# Altium project IBB.PrjPcb (part 7 of 12)
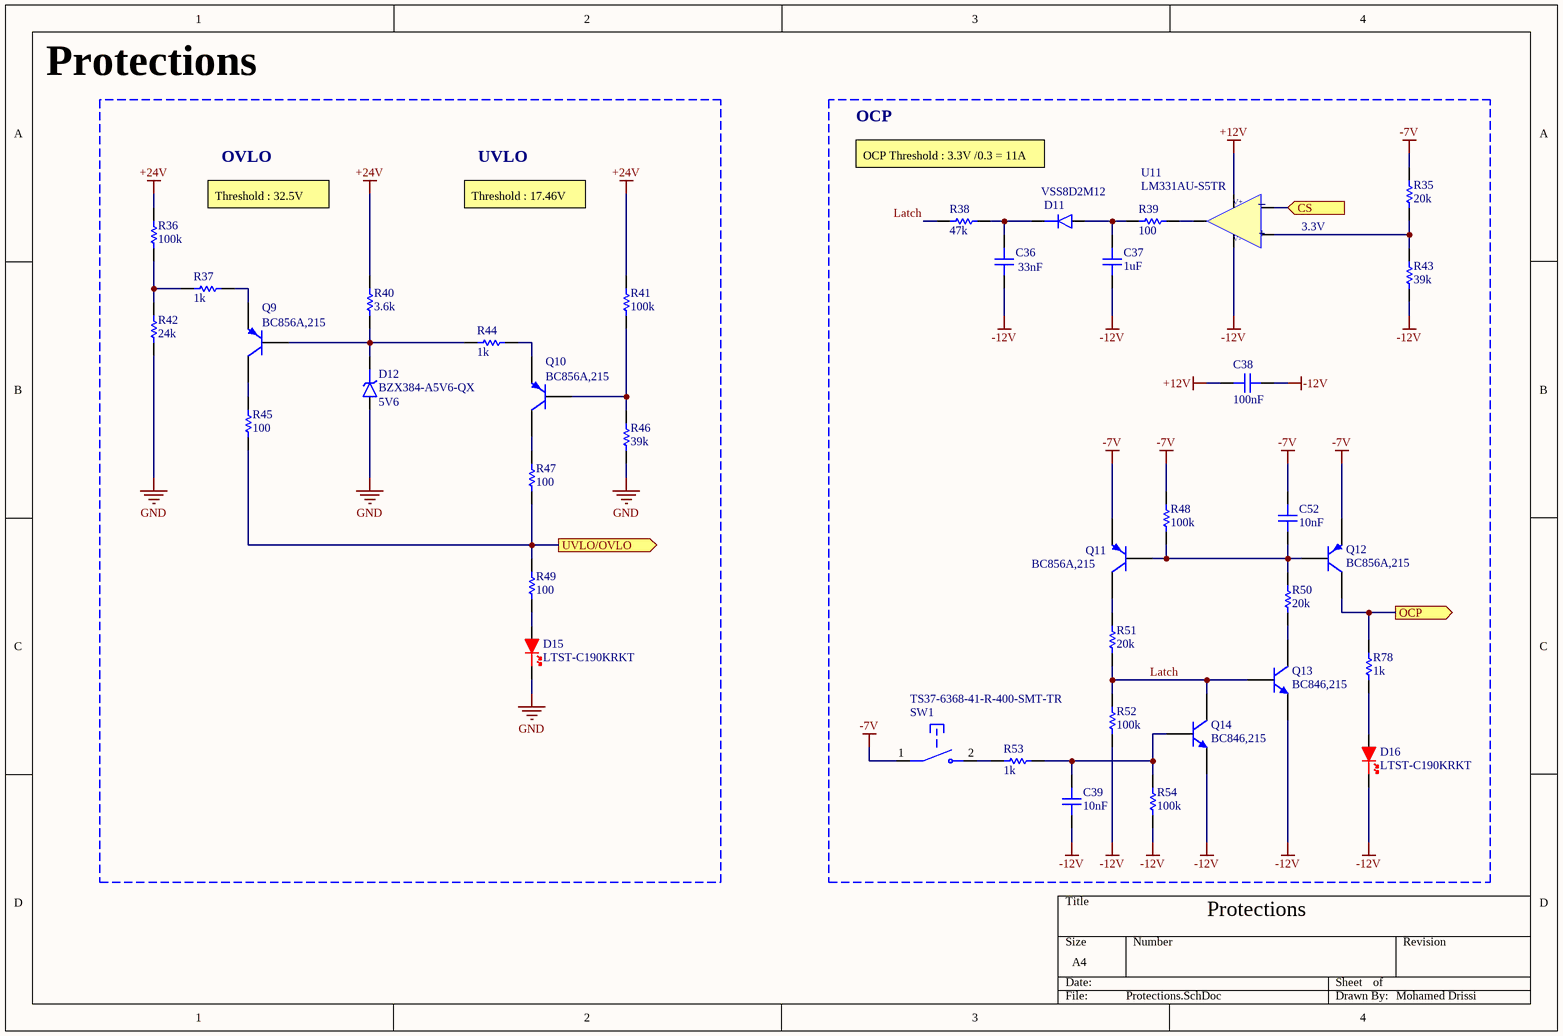
[diagram p12: Protections.SchDoc]

## Sheet Protections.SchDoc (continued)

### Library data of the parts (continued)
R38 = Yageo RC0603FR-0747KL: Res Thick Film 0603 47K Ohm 1% 1/10W ±100ppm/°C Molded SMD Paper T/R; Manufacturer: Yageo Group; Max Power Dissipation: 100mW; Voltage Rating: 50V; Working Voltage: 75V; Supplier: RS; Supplier Part Number: 1995581P; Manufacturer Part Number: RC0603FR-0747KL; RoHS: Compliant; Category: Chip SMD Resistors; Stock: 23900; Pricing: 1000=0,007, 2500=0,007, 5000=0,006, 10000=0,005 (EUR); Case/Package: 0603; Case Code (Imperial): 0603; Case Code (Metric): 1608; China RoHS: Non-Compliant; Composition: Thick Film; Contact Plating: Tin; Country of Origin: Mainland China, Taiwan; Depth: 800µm; Export Control Classification Number (ECCN) Code: EAR99; Features: Moisture Resistant; Height: 450µm; Harmonized Tariff Schedule (HTS) Code: 8533.21.00.30; Introduction Date: 2008-07-18; Lead Free: Lead Free; Length: 1.6mm; Lifecycle Status: Production; Max Operating Temperature: 155°C; Military Standard: Not; Min Operating Temperature: -55°C; Mounting Technology: Surface Mount; Pins: 2; Number of Terminals: 2; Number of Terminations: 2; Packaging: Tape and Reel; Power Rating: 100mW; Radiation Hardening: No; REACH SVHC: Yes; Schedule B: 8533210045, 8533210045|8533210045|8533210045|8533210045|8533210045|8533210045|8533210045|8533210045|8533210045|8533210045|8533210045|8533210045|8533210045, 8533210045|8533210045|8533210045|8533210045|8533210045|8533210045|8533210045|8533210045|8533210045|8533210045|8533210045|8533210045|8533210045|8533210045, 8533210045|8533210045|8533210045|8533210045|8533210045|8533210045|8533210045|8533210045|8533210045|8533210045|8533210045|8533210045|8533210045|8533210045|8533210045; Temperature Coefficient: 100ppm/°C; Termination: SMD/SMT; Tolerance: 1%; Voltage Rating (AC): 50V; Voltage Rating (DC): 50V; Width: 800µm; ComponentLink1URL: https://datasheet.octopart.com:443/RC0603FR-0747KL-Yageo-datasheet-175887523.pdf?src-supplier=Newark; ComponentLink1Description: https://datasheet.octopart.com:443/RC0603FR-0747KL-Yageo-datasheet-175887523.pdf?src-supplier=Newark; ComponentLink2URL: https://datasheet.octopart.com:443/RC0603FR-0747KL-Yageo-datasheet-62067350.pdf?src-supplier=Newark; ComponentLink2Description: https://datasheet.octopart.com:443/RC0603FR-0747KL-Yageo-datasheet-62067350.pdf?src-supplier=Newark; ComponentLink3URL: https://datasheet.octopart.com:443/RC0603FR-0747KL-Yageo-datasheet-34211833.pdf?src-supplier=Newark; ComponentLink3Description: https://datasheet.octopart.com:443/RC0603FR-0747KL-Yageo-datasheet-34211833.pdf?src-supplier=Newark; ComponentLink4URL: https://datasheet.octopart.com:443/RC0603FR-0747KL-Yageo-datasheet-141265859.pdf?src-supplier=Upverter; ComponentLink4Description: https://datasheet.octopart.com:443/RC0603FR-0747KL-Yageo-datasheet-141265859.pdf?src-supplier=Upverter; ComponentLink5URL: https://datasheet.octopart.com:443/RC0603FR-0747KL-Yageo-datasheet-103092701.pdf?src-supplier=Upverter; ComponentLink5Description: https://datasheet.octopart.com:443/RC0603FR-0747KL-Yageo-datasheet-103092701.pdf?src-supplier=Upverter; ComponentLink6URL: https://sigma.octopart.com:443/138820526/technical_drawing/Yageo-RC0603FR-0747KL.pdf?src-supplier=Upverter; ComponentLink6Description: https://sigma.octopart.com:443/138820526/technical_drawing/Yageo-RC0603FR-0747KL.pdf?src-supplier=Upverter; ComponentLink7URL: https://datasheet.octopart.com:443/RC0603FR-0747KL-Yageo-datasheet-8328172.pdf?src-supplier=element14+APAC; ComponentLink7Description: https://datasheet.octopart.com:443/RC0603FR-0747KL-Yageo-datasheet-8328172.pdf?src-supplier=element14+APAC; ComponentLink8URL: https://datasheet.octopart.com:443/RC0603FR-0747KL-Yageo-Group-datasheet-190305687.pdf?src-supplier=Future+Electronics; ComponentLink8Description: https://datasheet.octopart.com:443/RC0603FR-0747KL-Yageo-Group-datasheet-190305687.pdf?src-supplier=Future+Electronics; ComponentLink9URL: https://datasheet.octopart.com:443/RC0603FR-0747KL-Yageo-datasheet-164759695.pdf?src-supplier=Future+Electronics; ComponentLink9Description: https://datasheet.octopart.com:443/RC0603FR-0747KL-Yageo-datasheet-164759695.pdf?src-supplier=Future+Electronics; ComponentLink10URL: https://datasheet.octopart.com:443/RC0603FR-0747KL-Yageo-datasheet-137700087.pdf?src-supplier=Future+Electronics; ComponentLink10Description: https://datasheet.octopart.com:443/RC0603FR-0747KL-Yageo-datasheet-137700087.pdf?src-supplier=Future+Electronics; ComponentLink11URL: https://datasheet.octopart.com:443/RC0603FR-0747KL-Yageo-datasheet-27584510.pdf?src-supplier=Future+Electronics; ComponentLink11Description: https://datasheet.octopart.com:443/RC0603FR-0747KL-Yageo-datasheet-27584510.pdf?src-supplier=Future+Electronics; ComponentLink12URL: https://datasheet.octopart.com:443/RC0603FR-0747KL-Yageo-datasheet-15599030.pdf?src-supplier=Future+Electronics; ComponentLink12Description: https://datasheet.octopart.com:443/RC0603FR-0747KL-Yageo-datasheet-15599030.pdf?src-supplier=Future+Electronics; ComponentLink13URL: https://datasheet.octopart.com:443/RC0603FR-0747KL-Yageo-datasheet-12596169.pdf?src-supplier=Future+Electronics; ComponentLink13Description: https://datasheet.octopart.com:443/RC0603FR-0747KL-Yageo-datasheet-12596169.pdf?src-supplier=Future+Electronics; ComponentLink14URL: https://datasheet.octopart.com:443/RC0603FR-0747KL-Yageo-datasheet-79472498.pdf?src-supplier=Megastar; ComponentLink14Description: https://datasheet.octopart.com:443/RC0603FR-0747KL-Yageo-datasheet-79472498.pdf?src-supplier=Megastar; ComponentLink15URL: https://datasheet.octopart.com/RC0603FR-0747KL-Yageo-datasheet-73766026.pdf; ComponentLink15Description: https://datasheet.octopart.com/RC0603FR-0747KL-Yageo-datasheet-73766026.pdf; ComponentLink16URL: https://datasheet.octopart.com:443/RC0603FR-0747KL-Yageo-datasheet-13691069.pdf?src-supplier=Farnell; ComponentLink16Description: https://datasheet.octopart.com:443/RC0603FR-0747KL-Yageo-datasheet-13691069.pdf?src-supplier=Farnell; ComponentLink17URL: https://datasheet.octopart.com:443/RC0603FR-0747KL-Yageo-datasheet-118562.pdf?src-supplier=DigiKey; ComponentLink17Description: https://datasheet.octopart.com:443/RC0603FR-0747KL-Yageo-datasheet-118562.pdf?src-supplier=DigiKey; ComponentLink18URL: https://datasheet.octopart.com:443/RC0603FR-0747KL-Yageo-datasheet-499455.pdf?src-supplier=element14; ComponentLink18Description: https://datasheet.octopart.com:443/RC0603FR-0747KL-Yageo-datasheet-499455.pdf?src-supplier=element14; ComponentLink19URL: http://sigma.octopart.com:80/conflict_mineral_statement/Yageo-company-3.pdf?src-supplier=Compliance+Statements; ComponentLink19Description: http://sigma.octopart.com:80/conflict_mineral_statement/Yageo-company-3.pdf?src-supplier=Compliance+Statements; ComponentLink20URL: http://sigma.octopart.com:80/rohs_statement/Yageo-company-2.pdf?src-supplier=Compliance+Statements; ComponentLink20Description: http://sigma.octopart.com:80/rohs_statement/Yageo-company-2.pdf?src-supplier=Compliance+Statements
R39 R45 R47 R49 = Yageo RC0603FR-07100RL: Yageo RC0603FR-07100RL 0603 SMD Resistor 100 Ohm thin film chip resistor; Manufacturer: Yageo Group; Power Rating: 100mW; Temperature Coefficient: 100ppm/°C; Tolerance: 1%; Voltage Rating: 75V; Voltage Rating (DC): 50V; Supplier: RS; Supplier Part Number: 1995441P; Manufacturer Part Number: RC0603FR-07100RL; RoHS: Compliant; Category: Chip SMD Resistors; Stock: 48300; Pricing: 1000=0,007, 2500=0,007, 5000=0,006, 10000=0,005 (EUR); Case/Package: 0603; Case Code (Imperial): 0603; Case Code (Metric): 0603; China RoHS: Non-Compliant; Composition: Thick Film; Contact Plating: Tin; Depth: 800µm; Height: 450µm; Lead Free: Lead Free; Length: 1.6mm; Lifecycle Status: Production; Max Operating Temperature: 155°C; Military Standard: Not; Min Operating Temperature: -55°C; Mounting Technology: Surface Mount; Pins: 2; Number of Terminals: 2; Packaging: Cut Tape (CT); Radiation Hardening: No; REACH SVHC: Yes; Schedule B: 8533210045, 8533210045|8533210045|8533210045|8533210045|8533210045|8533210045|8533210045|8533210045|8533210045|8533210045|8533210045|8533210045|8533210045|8533210045|8533210045|8533210045|8533210045|8533210045|8533210045|8533210045|8533210045|8533210045|8533210045|85; Termination: SMD/SMT; Width: 800µm; Working Voltage: 75V; ComponentLink1URL: https://datasheet.octopart.com:443/RC0603FR-07100RL-Yageo-datasheet-175887523.pdf?src-supplier=IHS; ComponentLink1Description: https://datasheet.octopart.com:443/RC0603FR-07100RL-Yageo-datasheet-175887523.pdf?src-supplier=IHS; ComponentLink2URL: https://datasheet.octopart.com:443/RC0603FR-07100RL-Yageo-datasheet-8328172.pdf?src-supplier=Newark; ComponentLink2Description: https://datasheet.octopart.com:443/RC0603FR-07100RL-Yageo-datasheet-8328172.pdf?src-supplier=Newark; ComponentLink3URL: https://datasheet.octopart.com:443/RC0603FR-07100RL-Yageo-datasheet-34211833.pdf?src-supplier=Newark; ComponentLink3Description: https://datasheet.octopart.com:443/RC0603FR-07100RL-Yageo-datasheet-34211833.pdf?src-supplier=Newark; ComponentLink4URL: https://datasheet.octopart.com:443/RC0603FR-07100RL-Yageo-datasheet-103092701.pdf?src-supplier=Upverter; ComponentLink4Description: https://datasheet.octopart.com:443/RC0603FR-07100RL-Yageo-datasheet-103092701.pdf?src-supplier=Upverter; ComponentLink5URL: https://datasheet.octopart.com:443/RC0603FR-07100RL-Yageo-datasheet-62067350.pdf?src-supplier=element14+APAC; ComponentLink5Description: https://datasheet.octopart.com:443/RC0603FR-07100RL-Yageo-datasheet-62067350.pdf?src-supplier=element14+APAC; ComponentLink6URL: https://datasheet.octopart.com:443/RC0603FR-07100RL-Yageo-datasheet-17842380.pdf?src-supplier=element14+APAC; ComponentLink6Description: https://datasheet.octopart.com:443/RC0603FR-07100RL-Yageo-datasheet-17842380.pdf?src-supplier=element14+APAC; ComponentLink7URL: https://datasheet.octopart.com:443/RC0603FR-07100RL-Yageo-datasheet-12596169.pdf?src-supplier=Future+Electronics; ComponentLink7Description: https://datasheet.octopart.com:443/RC0603FR-07100RL-Yageo-datasheet-12596169.pdf?src-supplier=Future+Electronics; ComponentLink8URL: https://datasheet.octopart.com:443/RC0603FR-07100RL-Yageo-Group-datasheet-176638170.pdf?src-supplier=Future+Electronics; ComponentLink8Description: https://datasheet.octopart.com:443/RC0603FR-07100RL-Yageo-Group-datasheet-176638170.pdf?src-supplier=Future+Electronics; ComponentLink9URL: https://datasheet.octopart.com:443/RC0603FR-07100RL-Yageo-datasheet-164759695.pdf?src-supplier=Future+Electronics; ComponentLink9Description: https://datasheet.octopart.com:443/RC0603FR-07100RL-Yageo-datasheet-164759695.pdf?src-supplier=Future+Electronics; ComponentLink10URL: https://datasheet.octopart.com:443/RC0603FR-07100RL-Yageo-datasheet-137700087.pdf?src-supplier=Future+Electronics; ComponentLink10Description: https://datasheet.octopart.com:443/RC0603FR-07100RL-Yageo-datasheet-137700087.pdf?src-supplier=Future+Electronics; ComponentLink11URL: https://datasheet.octopart.com:443/RC0603FR07100RL-Yageo-datasheet-27584510.pdf?src-supplier=Future+Electronics; ComponentLink11Description: https://datasheet.octopart.com:443/RC0603FR07100RL-Yageo-datasheet-27584510.pdf?src-supplier=Future+Electronics; ComponentLink12URL: https://datasheet.octopart.com:443/RC0603FR-07100RL-Yageo-datasheet-15599030.pdf?src-supplier=Future+Electronics; ComponentLink12Description: https://datasheet.octopart.com:443/RC0603FR-07100RL-Yageo-datasheet-15599030.pdf?src-supplier=Future+Electronics; ComponentLink13URL: https://datasheet.octopart.com:443/RC0603FR-07100RL-Yageo-datasheet-8324193.pdf?src-supplier=Future+Electronics; ComponentLink13Description: https://datasheet.octopart.com:443/RC0603FR-07100RL-Yageo-datasheet-8324193.pdf?src-supplier=Future+Electronics; ComponentLink14URL: https://datasheet.octopart.com:443/RC0603FR-07100RL-Yageo-datasheet-79472498.pdf?src-supplier=Megastar; ComponentLink14Description: https://datasheet.octopart.com:443/RC0603FR-07100RL-Yageo-datasheet-79472498.pdf?src-supplier=Megastar; ComponentLink15URL: https://datasheet.octopart.com/RC0603FR-07100RL-Yageo-datasheet-73766026.pdf; ComponentLink15Description: https://datasheet.octopart.com/RC0603FR-07100RL-Yageo-datasheet-73766026.pdf; ComponentLink16URL: https://datasheet.octopart.com:443/RC0603FR-07100RL-Yageo-datasheet-13691069.pdf?src-supplier=Farnell; ComponentLink16Description: https://datasheet.octopart.com:443/RC0603FR-07100RL-Yageo-datasheet-13691069.pdf?src-supplier=Farnell; ComponentLink17URL: https://datasheet.octopart.com:443/RC0603FR-07100RL-Yageo-datasheet-118562.pdf?src-supplier=DigiKey; ComponentLink17Description: https://datasheet.octopart.com:443/RC0603FR-07100RL-Yageo-datasheet-118562.pdf?src-supplier=DigiKey; ComponentLink18URL: http://sigma.octopart.com:80/conflict_mineral_statement/Yageo-company-3.pdf?src-supplier=Compliance+Statements; ComponentLink18Description: http://sigma.octopart.com:80/conflict_mineral_statement/Yageo-company-3.pdf?src-supplier=Compliance+Statements; ComponentLink19URL: http://sigma.octopart.com:80/rohs_statement/Yageo-company-2.pdf?src-supplier=Compliance+Statements; ComponentLink19Description: http://sigma.octopart.com:80/rohs_statement/Yageo-company-2.pdf?src-supplier=Compliance+Statements
R40 = YageoRC0603FR-073K6L: 100mW Thick Film Resistors 75V ±100ppm/℃ ±1% 3.6kΩ 0603 Chip Resistor - Surface Mount ROHS; Manufacturer: Yageo Group; Max Supply Voltage: 5.5V; Min Supply Voltage: 4.5V; Nominal Supply Voltage (DC): 5V; Output Current: 10mA; Temperature Coefficient: 100ppm/°C; Voltage Rating (DC): 50V; Supplier: RS; Supplier Part Number: 2424123; Manufacturer Part Number: RC0603FR-073K6L; RoHS: Compliant; Category: Chip SMD Resistors; Stock: 8300; Pricing: 100=0,004, 1000=0,003, 2000=0,003 (EUR); Case/Package: 0603; Case Code (Imperial): 0603; China RoHS: Non-Compliant; Composition: Thick Film; Features: Moisture Resistant; Height: 450µm; Lead Free: Lead Free; Length: 1.6mm; Lifecycle Status: Production; Max Operating Temperature: 155°C; Max Power Dissipation: 100mW; Min Operating Temperature: -55°C; Mounting Technology: Surface Mount; Pins: 2; Number of Terminals: 2; Number of Terminations: 2; Packaging: Bulk; Power Rating: 100mW; Radiation Hardening: No; REACH SVHC: Yes; Schedule B: 8533210045, 8533210045|8533210045|8533210045|8533210045|8533210045; Termination: SMD/SMT; Tolerance: 1%; Voltage Rating: 75V; Width: 800µm; Working Voltage: 75V; ComponentLink1URL: https://datasheet.octopart.com:443/RC0603FR-073K6L-Yageo-datasheet-175887523.pdf?src-supplier=IHS; ComponentLink1Description: https://datasheet.octopart.com:443/RC0603FR-073K6L-Yageo-datasheet-175887523.pdf?src-supplier=IHS; ComponentLink2URL: https://datasheet.octopart.com:443/RC0603FR-073K6L-Yageo-datasheet-62067350.pdf?src-supplier=Farnell; ComponentLink2Description: https://datasheet.octopart.com:443/RC0603FR-073K6L-Yageo-datasheet-62067350.pdf?src-supplier=Farnell; ComponentLink3URL: https://datasheet.octopart.com:443/RC0603FR-073K6L-Yageo-datasheet-103092701.pdf?src-supplier=Upverter; ComponentLink3Description: https://datasheet.octopart.com:443/RC0603FR-073K6L-Yageo-datasheet-103092701.pdf?src-supplier=Upverter; ComponentLink4URL: https://datasheet.octopart.com:443/RC0603FR-073K6L-Yageo-datasheet-98239111.pdf?src-supplier=Upverter; ComponentLink4Description: https://datasheet.octopart.com:443/RC0603FR-073K6L-Yageo-datasheet-98239111.pdf?src-supplier=Upverter; ComponentLink5URL: https://datasheet.octopart.com:443/RC0603FR-073K6L-Yageo-Group-datasheet-190305687.pdf?src-supplier=Future+Electronics; ComponentLink5Description: https://datasheet.octopart.com:443/RC0603FR-073K6L-Yageo-Group-datasheet-190305687.pdf?src-supplier=Future+Electronics; ComponentLink6URL: https://datasheet.octopart.com:443/RC0603FR-073K6L-Yageo-datasheet-164759695.pdf?src-supplier=Future+Electronics; ComponentLink6Description: https://datasheet.octopart.com:443/RC0603FR-073K6L-Yageo-datasheet-164759695.pdf?src-supplier=Future+Electronics; ComponentLink7URL: https://datasheet.octopart.com:443/RC0603FR-073K6L-Yageo-datasheet-137700087.pdf?src-supplier=Future+Electronics; ComponentLink7Description: https://datasheet.octopart.com:443/RC0603FR-073K6L-Yageo-datasheet-137700087.pdf?src-supplier=Future+Electronics; ComponentLink8URL: https://datasheet.octopart.com:443/RC0603FR-073K6L-Yageo-datasheet-27584510.pdf?src-supplier=Future+Electronics; ComponentLink8Description: https://datasheet.octopart.com:443/RC0603FR-073K6L-Yageo-datasheet-27584510.pdf?src-supplier=Future+Electronics; ComponentLink9URL: https://datasheet.octopart.com:443/RC0603FR-073K6L-Yageo-datasheet-15599030.pdf?src-supplier=Future+Electronics; ComponentLink9Description: https://datasheet.octopart.com:443/RC0603FR-073K6L-Yageo-datasheet-15599030.pdf?src-supplier=Future+Electronics; ComponentLink10URL: https://datasheet.octopart.com:443/RC0603FR-073K6L-Yageo-datasheet-12596169.pdf?src-supplier=Future+Electronics; ComponentLink10Description: https://datasheet.octopart.com:443/RC0603FR-073K6L-Yageo-datasheet-12596169.pdf?src-supplier=Future+Electronics; ComponentLink11URL: https://datasheet.octopart.com:443/RC0603FR-073K6L-Yageo-datasheet-8324193.pdf?src-supplier=Future+Electronics; ComponentLink11Description: https://datasheet.octopart.com:443/RC0603FR-073K6L-Yageo-datasheet-8324193.pdf?src-supplier=Future+Electronics; ComponentLink12URL: https://datasheet.octopart.com:443/RC0603FR-073K6L-Yageo-datasheet-34211833.pdf?src-supplier=element14+APAC; ComponentLink12Description: https://datasheet.octopart.com:443/RC0603FR-073K6L-Yageo-datasheet-34211833.pdf?src-supplier=element14+APAC; ComponentLink13URL: https://datasheet.octopart.com:443/RC0603FR-073K6L-Yageo-datasheet-8328172.pdf?src-supplier=Newark; ComponentLink13Description: https://datasheet.octopart.com:443/RC0603FR-073K6L-Yageo-datasheet-8328172.pdf?src-supplier=Newark; ComponentLink14URL: https://datasheet.octopart.com:443/RC0603FR-073K6L-Yageo-datasheet-148775077.pdf?src-supplier=TME; ComponentLink14Description: https://datasheet.octopart.com:443/RC0603FR-073K6L-Yageo-datasheet-148775077.pdf?src-supplier=TME; ComponentLink15URL: https://datasheet.octopart.com:443/RC0603FR-073K6L-Yageo-datasheet-79472498.pdf?src-supplier=Megastar; ComponentLink15Description: https://datasheet.octopart.com:443/RC0603FR-073K6L-Yageo-datasheet-79472498.pdf?src-supplier=Megastar; ComponentLink16URL: https://datasheet.octopart.com/RC0603FR-073K6L-Yageo-datasheet-73766026.pdf; ComponentLink16Description: https://datasheet.octopart.com/RC0603FR-073K6L-Yageo-datasheet-73766026.pdf; ComponentLink17URL: https://datasheet.octopart.com:443/RC0603FR-073K6L-Yageo-datasheet-118562.pdf?src-supplier=DigiKey; ComponentLink17Description: https://datasheet.octopart.com:443/RC0603FR-073K6L-Yageo-datasheet-118562.pdf?src-supplier=DigiKey; ComponentLink18URL: http://sigma.octopart.com:80/conflict_mineral_statement/Yageo-company-3.pdf?src-supplier=Compliance+Statements; ComponentLink18Description: http://sigma.octopart.com:80/conflict_mineral_statement/Yageo-company-3.pdf?src-supplier=Compliance+Statements; ComponentLink19URL: http://sigma.octopart.com:80/rohs_statement/Yageo-company-2.pdf?src-supplier=Compliance+Statements; ComponentLink19Description: http://sigma.octopart.com:80/rohs_statement/Yageo-company-2.pdf?src-supplier=Compliance+Statements
R42 = Yageo RC0603FR-0724KL: 100mW Thick Film Resistors 75V ±100ppm/℃ ±1% 24kΩ 0603 Chip Resistor - Surface Mount ROHS; Manufacturer: Yageo Group; Temperature Coefficient: 100ppm/°C; Voltage Rating (DC): 50V; Supplier: RS; Supplier Part Number: 1995507; Manufacturer Part Number: RC0603FR-0724KL; RoHS: Compliant; Category: Chip SMD Resistors; Stock: 1600; Pricing: 100=0,010, 1000=0,005, 2500=0,004, 5000=0,003, 10000=0,003 (EUR); Case/Package: 0603; Case Code (Imperial): 0603; China RoHS: Non-Compliant; Composition: Thick Film; Country of Origin: Mainland China, Taiwan; Depth: 800µm; Export Control Classification Number (ECCN) Code: EAR99; Features: Moisture Resistant; Height: 450µm; Harmonized Tariff Schedule (HTS) Code: 8533.21.00.30; Introduction Date: 2008-07-18; Lead Free: Lead Free; Length: 1.6mm; Lifecycle Status: Production; Max Operating Temperature: 155°C; Max Power Dissipation: 100mW; Military Standard: Not; Min Operating Temperature: -55°C; Mounting Technology: Surface Mount; Number of Terminals: 2; Number of Terminations: 2; Packaging: Tape & Reel; Power Rating: 100mW; REACH SVHC: Yes; Schedule B: 8533210045, 8533210045|8533210045, 8533210045|8533210045|8533210045, 8533210045|8533210045|8533210045|8533210045; Termination: SMD/SMT; Tolerance: 1%; Voltage Rating: 75V; Width: 800µm; Working Voltage: 75V; ComponentLink1URL: https://datasheet.octopart.com:443/RC0603FR-0724KL-Yageo-datasheet-175887523.pdf?src-supplier=Newark; ComponentLink1Description: https://datasheet.octopart.com:443/RC0603FR-0724KL-Yageo-datasheet-175887523.pdf?src-supplier=Newark; ComponentLink2URL: https://datasheet.octopart.com:443/RC0603FR-0724KL-Yageo-datasheet-8328172.pdf?src-supplier=Upverter; ComponentLink2Description: https://datasheet.octopart.com:443/RC0603FR-0724KL-Yageo-datasheet-8328172.pdf?src-supplier=Upverter; ComponentLink3URL: https://datasheet.octopart.com:443/RC0603FR-0724KL-Yageo-datasheet-103092701.pdf?src-supplier=Upverter; ComponentLink3Description: https://datasheet.octopart.com:443/RC0603FR-0724KL-Yageo-datasheet-103092701.pdf?src-supplier=Upverter; ComponentLink4URL: https://datasheet.octopart.com:443/RC0603FR-0724KL-Yageo-Group-datasheet-190305687.pdf?src-supplier=Future+Electronics; ComponentLink4Description: https://datasheet.octopart.com:443/RC0603FR-0724KL-Yageo-Group-datasheet-190305687.pdf?src-supplier=Future+Electronics; ComponentLink5URL: https://datasheet.octopart.com:443/RC0603FR-0724KL-Yageo-datasheet-164759695.pdf?src-supplier=Future+Electronics; ComponentLink5Description: https://datasheet.octopart.com:443/RC0603FR-0724KL-Yageo-datasheet-164759695.pdf?src-supplier=Future+Electronics; ComponentLink6URL: https://datasheet.octopart.com:443/RC0603FR-0724KL-Yageo-datasheet-137700087.pdf?src-supplier=Future+Electronics; ComponentLink6Description: https://datasheet.octopart.com:443/RC0603FR-0724KL-Yageo-datasheet-137700087.pdf?src-supplier=Future+Electronics; ComponentLink7URL: https://datasheet.octopart.com:443/RC0603FR-0724KL-Yageo-datasheet-101672632.pdf?src-supplier=Future+Electronics; ComponentLink7Description: https://datasheet.octopart.com:443/RC0603FR-0724KL-Yageo-datasheet-101672632.pdf?src-supplier=Future+Electronics; ComponentLink8URL: https://datasheet.octopart.com:443/RC0603FR-0724KL-Yageo-datasheet-15599030.pdf?src-supplier=Future+Electronics; ComponentLink8Description: https://datasheet.octopart.com:443/RC0603FR-0724KL-Yageo-datasheet-15599030.pdf?src-supplier=Future+Electronics; ComponentLink9URL: https://datasheet.octopart.com:443/RC0603FR-0724KL-Yageo-datasheet-12596169.pdf?src-supplier=Future+Electronics; ComponentLink9Description: https://datasheet.octopart.com:443/RC0603FR-0724KL-Yageo-datasheet-12596169.pdf?src-supplier=Future+Electronics; ComponentLink10URL: https://datasheet.octopart.com:443/RC0603FR-0724KL-Yageo-datasheet-8324193.pdf?src-supplier=Future+Electronics; ComponentLink10Description: https://datasheet.octopart.com:443/RC0603FR-0724KL-Yageo-datasheet-8324193.pdf?src-supplier=Future+Electronics; ComponentLink11URL: https://datasheet.octopart.com:443/RC0603FR-0724KL-Yageo-datasheet-176638170.pdf?src-supplier=Farnell; ComponentLink11Description: https://datasheet.octopart.com:443/RC0603FR-0724KL-Yageo-datasheet-176638170.pdf?src-supplier=Farnell; ComponentLink12URL: https://datasheet.octopart.com:443/RC0603FR-0724KL-Yageo-datasheet-148775077.pdf?src-supplier=TME; ComponentLink12Description: https://datasheet.octopart.com:443/RC0603FR-0724KL-Yageo-datasheet-148775077.pdf?src-supplier=TME; ComponentLink13URL: https://datasheet.octopart.com/RC0603FR-0724KL-Yageo-datasheet-73766026.pdf; ComponentLink13Description: https://datasheet.octopart.com/RC0603FR-0724KL-Yageo-datasheet-73766026.pdf; ComponentLink14URL: https://datasheet.octopart.com:443/RC0603FR-0724KL-Yageo-datasheet-30459151.pdf?src-supplier=Seeed+Studio; ComponentLink14Description: https://datasheet.octopart.com:443/RC0603FR-0724KL-Yageo-datasheet-30459151.pdf?src-supplier=Seeed+Studio; ComponentLink15URL: https://datasheet.octopart.com:443/RC0603FR-0724KL-Yageo-datasheet-118562.pdf?src-supplier=DigiKey; ComponentLink15Description: https://datasheet.octopart.com:443/RC0603FR-0724KL-Yageo-datasheet-118562.pdf?src-supplier=DigiKey; ComponentLink16URL: http://sigma.octopart.com:80/conflict_mineral_statement/Yageo-company-3.pdf?src-supplier=Compliance+Statements; ComponentLink16Description: http://sigma.octopart.com:80/conflict_mineral_statement/Yageo-company-3.pdf?src-supplier=Compliance+Statements; ComponentLink17URL: http://sigma.octopart.com:80/rohs_statement/Yageo-company-2.pdf?src-supplier=Compliance+Statements; ComponentLink17Description: http://sigma.octopart.com:80/rohs_statement/Yageo-company-2.pdf?src-supplier=Compliance+Statements
R43 = Vishay MCT06030C3902FP500: Res Thin Film 0603 39K Ohm 1% 1/10W ±50ppm/°C Molded SMD SMD Paper T/R; Manufacturer: Vishay; Max Power Dissipation: 125mW; Power Rating: 100mW; Voltage Rating: 75V; Supplier: Farnell; Supplier Part Number: MCT06030C3902FP500; Manufacturer Part Number: MCT06030C3902FP500; RoHS: Compliant; Category: Chip SMD Resistors; Stock: 25735; Pricing: 10=0,0241, 100=0,0174, 500=0,0153, 1000=0,0138, 2500=0,0136, 5000=0,0129 (GBP); Case/Package: 0603; Case Code (Imperial): 0603; Case Code (Metric): 1608; China RoHS: Non-Compliant; Composition: Thin Film; Contact Plating: Tin; Country of Origin: Germany, Israel; Depth: 850µm; Export Control Classification Number (ECCN) Code: EAR99; Height: 450µm; Harmonized Tariff Schedule (HTS) Code: 8533.21.00.30; Introduction Date: 2008-03-17; Lead Free: Lead Free; Length: 1.55mm; Lifecycle Status: Production; Max Operating Temperature: 125°C; Military Standard: Not; Min Operating Temperature: -55°C; Mounting Technology: Surface Mount; Number of Terminals: 2; Number of Terminations: 2; Radiation Hardening: No; REACH SVHC: Yes; Schedule B: 8533210045; Temperature Coefficient: 50ppm/°C; Tolerance: 1%; Voltage Rating (DC): 75V; Width: 850µm; Working Voltage: 75V; ComponentLink1URL: https://datasheet.octopart.com:443/MCT06030C3902FP500-Vishay-datasheet-182027961.pdf?src-supplier=IHS; ComponentLink1Description: https://datasheet.octopart.com:443/MCT06030C3902FP500-Vishay-datasheet-182027961.pdf?src-supplier=IHS; ComponentLink2URL: https://datasheet.octopart.com:443/MCT06030C3902FP500-Vishay-datasheet-81842982.pdf?src-supplier=Upverter; ComponentLink2Description: https://datasheet.octopart.com:443/MCT06030C3902FP500-Vishay-datasheet-81842982.pdf?src-supplier=Upverter; ComponentLink3URL: https://datasheet.octopart.com:443/MCT06030C3902FP500-Vishay-datasheet-165827201.pdf?src-supplier=Newark; ComponentLink3Description: https://datasheet.octopart.com:443/MCT06030C3902FP500-Vishay-datasheet-165827201.pdf?src-supplier=Newark; ComponentLink4URL: https://datasheet.octopart.com:443/MCT06030C3902FP500-Vishay-datasheet-66078241.pdf?src-supplier=Newark; ComponentLink4Description: https://datasheet.octopart.com:443/MCT06030C3902FP500-Vishay-datasheet-66078241.pdf?src-supplier=Newark; ComponentLink5URL: https://datasheet.octopart.com:443/MCT06030C3902FP500-Vishay-datasheet-57863180.pdf?src-supplier=Future+Electronics; ComponentLink5Description: https://datasheet.octopart.com:443/MCT06030C3902FP500-Vishay-datasheet-57863180.pdf?src-supplier=Future+Electronics; ComponentLink6URL: https://datasheet.octopart.com/MCT06030C3902FP500-Vishay-datasheet-12543201.pdf; ComponentLink6Description: https://datasheet.octopart.com/MCT06030C3902FP500-Vishay-datasheet-12543201.pdf; ComponentLink7URL: https://datasheet.octopart.com/MCT06030C3902FP500-Vishay-datasheet-12532999.pdf; ComponentLink7Description: https://datasheet.octopart.com/MCT06030C3902FP500-Vishay-datasheet-12532999.pdf; ComponentLink8URL: https://datasheet.octopart.com/MCT06030C3902FP500-Vishay-datasheet-12520289.pdf; ComponentLink8Description: https://datasheet.octopart.com/MCT06030C3902FP500-Vishay-datasheet-12520289.pdf; ComponentLink9URL: https://datasheet.octopart.com/MCT06030C3902FP500-Vishay-datasheet-12510709.pdf; ComponentLink9Description: https://datasheet.octopart.com/MCT06030C3902FP500-Vishay-datasheet-12510709.pdf; ComponentLink10URL: https://datasheet.octopart.com:443/MCT06030C3902FP500-Vishay-datasheet-166298980.pdf?src-supplier=Burklin+Elektronik; ComponentLink10Description: https://datasheet.octopart.com:443/MCT06030C3902FP500-Vishay-datasheet-166298980.pdf?src-supplier=Burklin+Elektronik; ComponentLink11URL: http://sigma.octopart.com:80/rohs_statement/Vishay-company-15.pdf?src-supplier=Compliance+Statements; ComponentLink11Description: http://sigma.octopart.com:80/rohs_statement/Vishay-company-15.pdf?src-supplier=Compliance+Statements
R46 = Yageo RC0603FR-0739KL: 100mW Thick Film Resistors 75V ±100ppm/℃ ±1% 39kΩ 0603 Chip Resistor - Surface Mount ROHS; Manufacturer: Yageo Group; Temperature Coefficient: 100ppm/°C; Voltage Rating (AC): 50V; Supplier: RS; Supplier Part Number: 1995557; Manufacturer Part Number: RC0603FR-0739KL; RoHS: Compliant; Category: Chip SMD Resistors; Stock: 18900; Pricing: 100=0,007, 1000=0,007, 2500=0,007, 5000=0,006, 10000=0,006 (EUR); Case/Package: 0603; Case Code (Imperial): 0603; China RoHS: Non-Compliant; Composition: Thick Film; Contact Plating: Tin; Depth: 800µm; Height: 450µm; Lead Free: Lead Free; Length: 1.6mm; Lifecycle Status: Production; Max Operating Temperature: 155°C; Military Standard: Not; Min Operating Temperature: -55°C; Mounting Technology: Surface Mount; Pins: 2; Number of Terminals: 2; Packaging: Tape & Reel; Power Rating: 100mW; Radiation Hardening: No; REACH SVHC: Yes; Schedule B: 8533210045, 8533210045|8533210045, 8533210045|8533210045|8533210045, 8533210045|8533210045|8533210045|8533210045; Termination: SMD/SMT; Tolerance: 1%; Voltage Rating: 75V; Voltage Rating (DC): 50V; Width: 800µm; Working Voltage: 75V; ComponentLink1URL: https://datasheet.octopart.com:443/RC0603FR-0739KL-Yageo-datasheet-175887523.pdf?src-supplier=Newark; ComponentLink1Description: https://datasheet.octopart.com:443/RC0603FR-0739KL-Yageo-datasheet-175887523.pdf?src-supplier=Newark; ComponentLink2URL: https://datasheet.octopart.com:443/RC0603FR-0739KL-Yageo-datasheet-8328172.pdf?src-supplier=Newark; ComponentLink2Description: https://datasheet.octopart.com:443/RC0603FR-0739KL-Yageo-datasheet-8328172.pdf?src-supplier=Newark; ComponentLink3URL: https://datasheet.octopart.com:443/RC0603FR-0739KL-Yageo-datasheet-34211833.pdf?src-supplier=Newark; ComponentLink3Description: https://datasheet.octopart.com:443/RC0603FR-0739KL-Yageo-datasheet-34211833.pdf?src-supplier=Newark; ComponentLink4URL: https://datasheet.octopart.com:443/RC0603FR-0739KL-Yageo-datasheet-103092701.pdf?src-supplier=Upverter; ComponentLink4Description: https://datasheet.octopart.com:443/RC0603FR-0739KL-Yageo-datasheet-103092701.pdf?src-supplier=Upverter; ComponentLink5URL: https://datasheet.octopart.com:443/RC0603FR-0739KL-Yageo-datasheet-62067350.pdf?src-supplier=Farnell; ComponentLink5Description: https://datasheet.octopart.com:443/RC0603FR-0739KL-Yageo-datasheet-62067350.pdf?src-supplier=Farnell; ComponentLink6URL: https://datasheet.octopart.com:443/RC0603FR-0739KL-Yageo-Group-datasheet-176638170.pdf?src-supplier=Future+Electronics; ComponentLink6Description: https://datasheet.octopart.com:443/RC0603FR-0739KL-Yageo-Group-datasheet-176638170.pdf?src-supplier=Future+Electronics; ComponentLink7URL: https://datasheet.octopart.com:443/RC0603FR-0739KL-Yageo-datasheet-164759695.pdf?src-supplier=Future+Electronics; ComponentLink7Description: https://datasheet.octopart.com:443/RC0603FR-0739KL-Yageo-datasheet-164759695.pdf?src-supplier=Future+Electronics; ComponentLink8URL: https://datasheet.octopart.com:443/RC0603FR-0739KL-Yageo-datasheet-137700087.pdf?src-supplier=Future+Electronics; ComponentLink8Description: https://datasheet.octopart.com:443/RC0603FR-0739KL-Yageo-datasheet-137700087.pdf?src-supplier=Future+Electronics; ComponentLink9URL: https://datasheet.octopart.com:443/RC0603FR0739KL-Yageo-datasheet-27584510.pdf?src-supplier=Future+Electronics; ComponentLink9Description: https://datasheet.octopart.com:443/RC0603FR0739KL-Yageo-datasheet-27584510.pdf?src-supplier=Future+Electronics; ComponentLink10URL: https://datasheet.octopart.com:443/RC0603FR-0739KL-Yageo-datasheet-15599030.pdf?src-supplier=Future+Electronics; ComponentLink10Description: https://datasheet.octopart.com:443/RC0603FR-0739KL-Yageo-datasheet-15599030.pdf?src-supplier=Future+Electronics; ComponentLink11URL: https://datasheet.octopart.com:443/RC0603FR-0739KL-Yageo-datasheet-12596169.pdf?src-supplier=Future+Electronics; ComponentLink11Description: https://datasheet.octopart.com:443/RC0603FR-0739KL-Yageo-datasheet-12596169.pdf?src-supplier=Future+Electronics; ComponentLink12URL: https://datasheet.octopart.com:443/RC0603FR-0739KL-Yageo-datasheet-8324193.pdf?src-supplier=Future+Electronics; ComponentLink12Description: https://datasheet.octopart.com:443/RC0603FR-0739KL-Yageo-datasheet-8324193.pdf?src-supplier=Future+Electronics; ComponentLink13URL: https://datasheet.octopart.com:443/RC0603FR-0739KL-Yageo-datasheet-148775077.pdf?src-supplier=TME; ComponentLink13Description: https://datasheet.octopart.com:443/RC0603FR-0739KL-Yageo-datasheet-148775077.pdf?src-supplier=TME; ComponentLink14URL: https://datasheet.octopart.com/RC0603FR-0739KL-Yageo-datasheet-73766026.pdf; ComponentLink14Description: https://datasheet.octopart.com/RC0603FR-0739KL-Yageo-datasheet-73766026.pdf; ComponentLink15URL: https://datasheet.octopart.com:443/RC0603FR-0739KL-Yageo-datasheet-118562.pdf?src-supplier=DigiKey; ComponentLink15Description: https://datasheet.octopart.com:443/RC0603FR-0739KL-Yageo-datasheet-118562.pdf?src-supplier=DigiKey; ComponentLink16URL: http://sigma.octopart.com:80/conflict_mineral_statement/Yageo-company-3.pdf?src-supplier=Compliance+Statements; ComponentLink16Description: http://sigma.octopart.com:80/conflict_mineral_statement/Yageo-company-3.pdf?src-supplier=Compliance+Statements; ComponentLink17URL: http://sigma.octopart.com:80/rohs_statement/Yageo-company-2.pdf?src-supplier=Compliance+Statements; ComponentLink17Description: http://sigma.octopart.com:80/rohs_statement/Yageo-company-2.pdf?src-supplier=Compliance+Statements
SW1 = Same Sky TS37-6368-41-R-400-SMT-TR: 6.3 x 6.8 mm, 4.1 mm Actuator Height Off PCB, 400 gf, Red, Surface Mount, SPST, Tactile Switch; Supplier: DigiKey; Supplier Part Number: 2223-TS37-6368-41-R-400-SMT-TR-ND; Manufacturer: Same Sky; Manufacturer Part Number: TS37-6368-41-R-400-SMT-TR; Category: Tactile Switches; Stock: 3899; Pricing: 1300=0,52996, 2600=0,5032, 3900=0,48887, 6500=0,47218, 9100=0,46198, 13000=0,45185 (USD); Lifecycle Status: Production; ComponentLink1URL: https://datasheet.octopart.com:443/TS37-6368-41-R-400-SMT-TR-Same-Sky-datasheet-191161330.pdf?src-supplier=Same+Sky; ComponentLink1Description: https://datasheet.octopart.com:443/TS37-6368-41-R-400-SMT-TR-Same-Sky-datasheet-191161330.pdf?src-supplier=Same+Sky; ComponentLink2URL: https://datasheet.octopart.com:443/TS37-6368-41-R-400-SMT-TR-Same-Sky-datasheet-191412509.pdf?src-supplier=element14+APAC; ComponentLink2Description: https://datasheet.octopart.com:443/TS37-6368-41-R-400-SMT-TR-Same-Sky-datasheet-191412509.pdf?src-supplier=element14+APAC
U11 = 3Peak LM331AU-S5TR: 150¦ÌA 500ns Open Collector, Rail to Rail 20mA 1 2.5V ¡À18V, 36V 6mV@ 5V 4nA@ 5V SOT-23-5 , 2.9mm; Manufacturer: 3Peak; Input Bias Current: 1nA; Input Offset Voltage (Vos): 6mV; Max Supply Current: 300µA; Max Supply Voltage: 42V; Number of Circuits: 1; Response Time: 2µs; Supplier: DigiKey; Supplier Part Number: 5503-LM331AU-S5TRCT-ND; Manufacturer Part Number: LM331AU-S5TR; RoHS: Compliant; Category: Amplifiers - Op Amps, Buffer, Instrumentation; Stock: 2199; Pricing: 1=0,1, 10=0,069, 25=0,06, 100=0,0505, 250=0,04588, 500=0,0431, 1000=0,04081 (USD); Case/Package: LSSOP; Export Control Classification Number (ECCN) Code: EAR99; Height - Seated (Max): 1.25mm; Harmonized Tariff Schedule (HTS) Code: 8542.39.00.60; Length: 2.92mm; Max Operating Temperature: 125°C; Min Operating Temperature: -40°C; Number of Terminals: 5; Operating Supply Voltage: 5V; REACH SVHC: Yes; Terminal Pitch: 950µm; Width: 1.61mm; ComponentLink1URL: https://datasheet.octopart.com:443/LM331AU-S5TR-3Peak-datasheet-182190405.pdf?src-supplier=IHS; ComponentLink1Description: https://datasheet.octopart.com:443/LM331AU-S5TR-3Peak-datasheet-182190405.pdf?src-supplier=IHS

## Sheet Linear regulators.SchDoc
size A3; Author: Mohamed Drissi; SheetNumber: 8; SheetTotal: 8
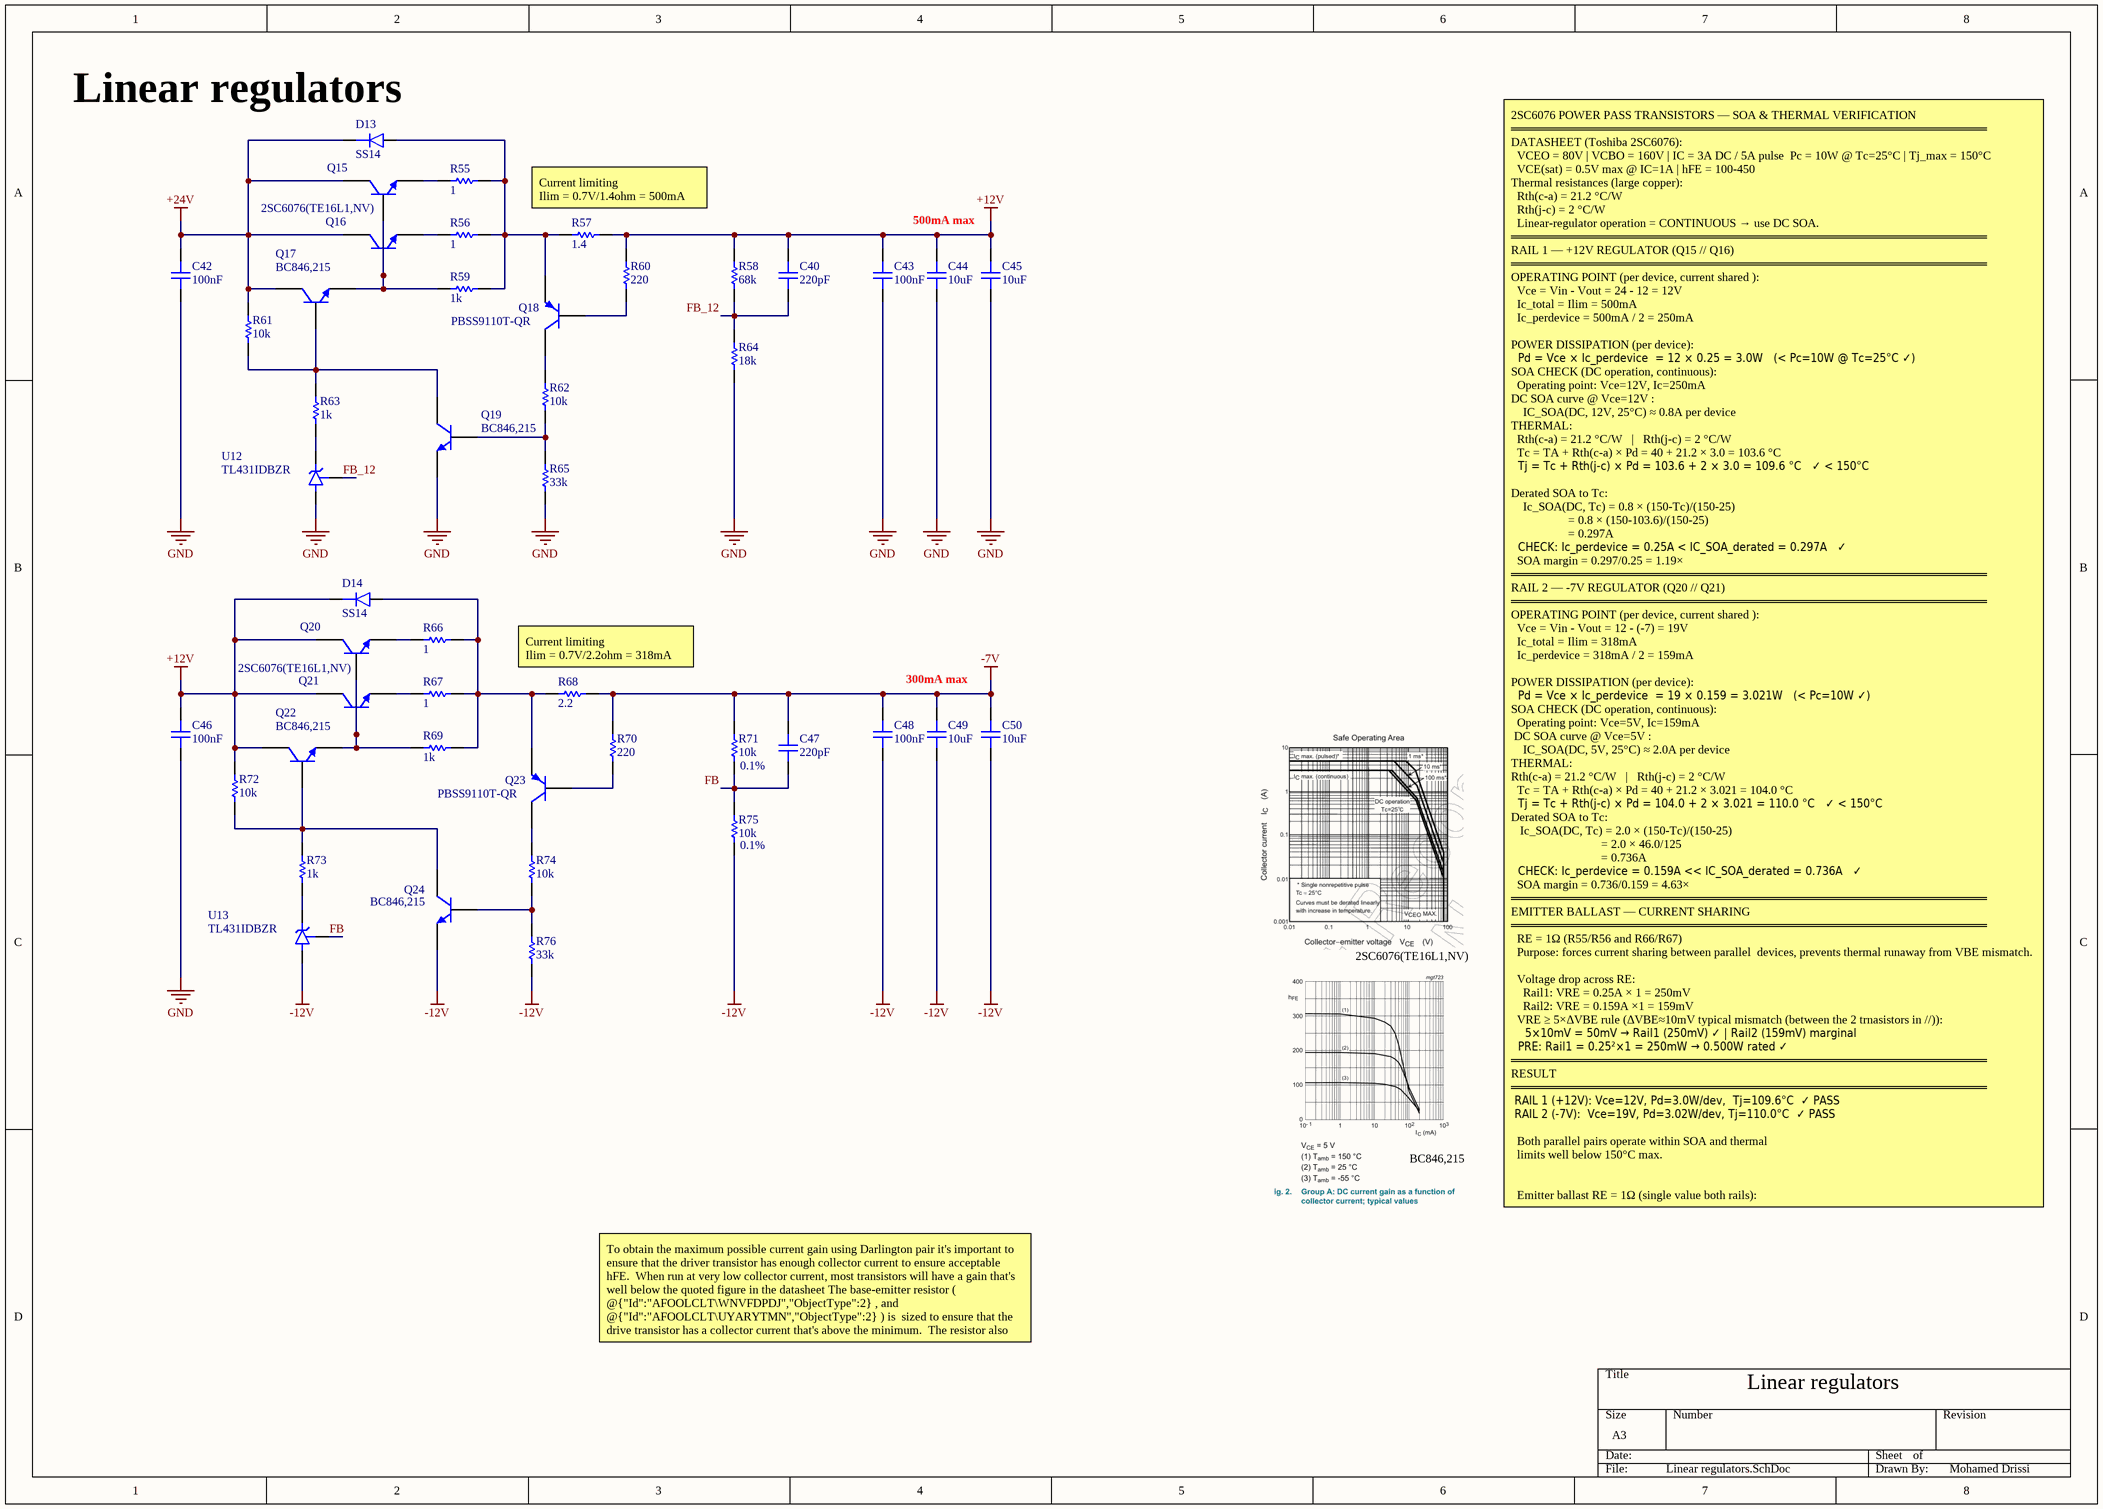
[diagram p6: Linear regulators.SchDoc]

### Parts
C40  Capacitance: 220pF  [cap_0603]  (hidden comment: CC0603JRNPO7BN221)
C42  Capacitance: 100nF  [cap_0603]  (hidden comment: GMC10X7R104K100NT)
C43  Capacitance: 100nF  [cap_0603]  (hidden comment: GMC10X7R104K100NT)
C44  Capacitance: 10uF  [cap_1210]  (hidden comment: 885012209073)
C45  Capacitance: 10uF  [cap_1210]  (hidden comment: 885012209073)
C46  Capacitance: 100nF  [cap_0603]  (hidden comment: GMC10X7R104K100NT)
C47  Capacitance: 220pF  [cap_0603]  (hidden comment: CC0603JRNPO7BN221)
C48  Capacitance: 100nF  [cap_0603]  (hidden comment: GMC10X7R104K100NT)
C49  Capacitance: 10uF  [cap_1210]  (hidden comment: 885012209073)
C50  Capacitance: 10uF  [cap_1210]  (hidden comment: 885012209073)
D13  SS14  [DO-214AC]
D14  SS14  [DO-214AC]
Q15  2SC6076(TE16L1,NV)  [TO-252  (DPAK)]  (value not drawn)
Q16  2SC6076(TE16L1,NV)  [TO-252  (DPAK)]
Q17  BC846,215  [sot23]
Q18  PBSS9110T-QR  [SOT23]
Q19  BC846,215  [sot23]
Q20  2SC6076(TE16L1,NV)  [TO-252  (DPAK)]  (value not drawn)
Q21  2SC6076(TE16L1,NV)  [TO-252  (DPAK)]
Q22  BC846,215  [sot23]
Q23  PBSS9110T-QR  [SOT23]
Q24  BC846,215  [sot23]
R55  Resistance: 1  [res_0603]  (hidden comment: RCS06031R00JNEA)
R56  Resistance: 1  [res_0603]  (hidden comment: RCS06031R00JNEA)
R57  Resistance: 1.4  [res_1206]  (hidden comment: CRCW12061R40FKEAHP)
R58  Resistance: 68k  [res_0603]  (hidden comment: CRGCQ0603J68K)
R59  Resistance: 1k  [res_0603]  (hidden comment: RC0603FR-071KL)
R60  Resistance: 220  [res_0603]  (hidden comment: CRGCQ0603J220R)
R61  Resistance: 10k  [res_0603]  (hidden comment: ERA-3AEB103V)
R62  Resistance: 10k  [res_0603]  (hidden comment: ERA-3AEB103V)
R63  Resistance: 1k  [res_0603]  (hidden comment: RC0603FR-071KL)
R64  Resistance: 18k  [res_0603]  (hidden comment: CRCW060318K0FKEAC)
R65  Resistance: 33k  [res_0603]  (hidden comment: RC0603JR-0733KL)
R66  Resistance: 1  [res_0603]  (hidden comment: RCS06031R00JNEA)
R67  Resistance: 1  [res_0603]  (hidden comment: RCS06031R00JNEA)
R68  Resistance: 2.2  [res_1206]  (hidden comment: CRM1206-JW-2R2ELF)
R69  Resistance: 1k  [res_0603]  (hidden comment: RC0603FR-071KL)
R70  Resistance: 220  [res_0603]  (hidden comment: CRGCQ0603J220R)
R71  Tolerance: 0.1%  Resistance: 10k  [res_0603]  (hidden comment: ERA-3AEB103V)
R72  Resistance: 10k  [res_0603]  (hidden comment: ERA-3AEB103V)
R73  Resistance: 1k  [res_0603]  (hidden comment: RC0603FR-071KL)
R74  Resistance: 10k  [res_0603]  (hidden comment: ERA-3AEB103V)
R75  Tolerance: 0.1%  Resistance: 10k  [res_0603]  (hidden comment: ERA-3AEB103V)
R76  Resistance: 33k  [res_0603]  (hidden comment: RC0603JR-0733KL)
U12  TL431IDBZR  [SOT-23-3]
U13  TL431IDBZR  [SOT-23-3]

### Nets
+12V: C40.2 C43.2 C44.2 C45.2 C46.2 D14.C Q20.2(C) Q21.2(C) Q22.3(C) R57.2 R58.2 R60.2 R72.2
+24V: C42.2 D13.C Q15.2(C) Q16.2(C) Q17.3(C) R61.2
-7V: C47.2 C48.2 C49.2 C50.2 R68.1 R70.2 R71.2
-12V: C48.1 C49.1 C50.1 Q24.2(E) R75.1 R76.1 U13.3(A)
GND: C42.1 C43.1 C44.1 C45.1 C46.1 Q19.2(E) R64.1 R65.1 U12.3(A)
FB: C47.1 R71.1 R75.2 U13.2(REF)
FB_12: C40.1 R58.1 R64.2 U12.2(REF)
NetD13_A: D13.A Q18.2(E) R55.2 R56.2 R57.1 R59.2
NetD14_A: D14.A Q23.2(E) R66.2 R67.2 R68.2 R69.2
NetQ15_1: Q15.1(B) Q16.1(B) Q17.2(E) R59.1
NetQ15_3: Q15.3(E) R55.1
NetQ16_3: Q16.3(E) R56.1
NetQ17_1: Q17.1(B) Q19.3(C) R61.1 R63.2
NetQ18_1: Q18.1(B) R60.1
NetQ18_3: Q18.3(C) R62.2
NetQ19_1: Q19.1(B) R62.1 R65.2
NetQ20_1: Q20.1(B) Q21.1(B) Q22.2(E) R69.1
NetQ20_3: Q20.3(E) R66.1
NetQ21_3: Q21.3(E) R67.1
NetQ22_1: Q22.1(B) Q24.3(C) R72.1 R73.2
NetQ23_1: Q23.1(B) R70.1
NetQ23_3: Q23.3(C) R74.2
NetQ24_1: Q24.1(B) R74.1 R76.2
NetR63_1: R63.1 U12.1(K)
NetR73_1: R73.1 U13.1(K)

### Notes on the sheet
- (near D13) Linear regulators
- (near R57) Current limiting
  Ilim = 0.7V/1.4ohm = 500mA
- 500mA max
- (near R68) Current limiting
  Ilim = 0.7V/2.2ohm = 318mA
- 300mA max
- 2SC6076(TE16L1,NV)
- BC846,215
- 2SC6076 POWER PASS TRANSISTORS — SOA & THERMAL VERIFICATION
  ════════════════════════════════════════════════════════
  DATASHEET (Toshiba 2SC6076):
  VCEO = 80V | VCBO = 160V | IC = 3A DC / 5A pulse  Pc = 10W @ Tc=25°C | Tj_max = 150°C
  VCE(sat) = 0.5V max @ IC=1A | hFE = 100-450
  Thermal resistances (large copper):
  Rth(c-a) = 21.2 °C/W
  Rth(j-c) = 2 °C/W
  Linear-regulator operation = CONTINUOUS → use DC SOA.
  ════════════════════════════════════════════════════════
  RAIL 1 — +12V REGULATOR (Q15 // Q16)
  ════════════════════════════════════════════════════════
  OPERATING POINT (per device, current shared ):
  Vce = Vin - Vout = 24 - 12 = 12V
  Ic_total = Ilim = 500mA
  Ic_perdevice = 500mA / 2 = 250mA
  POWER DISSIPATION (per device):
  Pd = Vce × Ic_perdevice  = 12 × 0.25 = 3.0W   (< Pc=10W @ Tc=25°C ✓)
  SOA CHECK (DC operation, continuous):
  Operating point: Vce=12V, Ic=250mA
  DC SOA curve @ Vce=12V :
  IC_SOA(DC, 12V, 25°C) ≈ 0.8A per device
  THERMAL:
  Rth(c-a) = 21.2 °C/W   |   Rth(j-c) = 2 °C/W
  Tc = TA + Rth(c-a) × Pd = 40 + 21.2 × 3.0 = 103.6 °C
  Tj = Tc + Rth(j-c) × Pd = 103.6 + 2 × 3.0 = 109.6 °C   ✓ < 150°C
  Derated SOA to Tc:
  Ic_SOA(DC, Tc) = 0.8 × (150-Tc)/(150-25)
  = 0.8 × (150-103.6)/(150-25)
  = 0.297A
  CHECK: Ic_perdevice = 0.25A < IC_SOA_derated = 0.297A   ✓
  SOA margin = 0.297/0.25 = 1.19×
  ════════════════════════════════════════════════════════
  RAIL 2 — -7V REGULATOR (Q20 // Q21)
  ════════════════════════════════════════════════════════
  OPERATING POINT (per device, current shared ):
  Vce = Vin - Vout = 12 - (-7) = 19V
  Ic_total = Ilim = 318mA
  Ic_perdevice = 318mA / 2 = 159mA
  POWER DISSIPATION (per device):
  Pd = Vce × Ic_perdevice  = 19 × 0.159 = 3.021W   (< Pc=10W ✓)
  SOA CHECK (DC operation, continuous):
  Operating point: Vce=5V, Ic=159mA
  DC SOA curve @ Vce=5V :
  IC_SOA(DC, 5V, 25°C) ≈ 2.0A per device
  THERMAL:
  Rth(c-a) = 21.2 °C/W   |   Rth(j-c) = 2 °C/W
  Tc = TA + Rth(c-a) × Pd = 40 + 21.2 × 3.021 = 104.0 °C
  Tj = Tc + Rth(j-c) × Pd = 104.0 + 2 × 3.021 = 110.0 °C   ✓ < 150°C
  Derated SOA to Tc:
  Ic_SOA(DC, Tc) = 2.0 × (150-Tc)/(150-25)
  = 2.0 × 46.0/125
  = 0.736A
  CHECK: Ic_perdevice = 0.159A << IC_SOA_derated = 0.736A   ✓
  SOA margin = 0.736/0.159 = 4.63×
  ════════════════════════════════════════════════════════
  EMITTER BALLAST — CURRENT SHARING
  ════════════════════════════════════════════════════════
  RE = 1Ω (R55/R56 and R66/R67)
  Purpose: forces current sharing between parallel  devices, prevents thermal runaway from VBE mismatch.
  Voltage drop across RE:
  Rail1: VRE = 0.25A × 1 = 250mV
  Rail2: VRE = 0.159A ×1 = 159mV
  VRE ≥ 5×ΔVBE rule (ΔVBE≈10mV typical mismatch (between the 2 trnasistors in //)):
  5×10mV = 50mV → Rail1 (250mV) ✓ | Rail2 (159mV) marginal
  PRE: Rail1 = 0.25²×1 = 250mW → 0.500W rated ✓
  ════════════════════════════════════════════════════════
  RESULT
  ════════════════════════════════════════════════════════
  RAIL 1 (+12V): Vce=12V, Pd=3.0W/dev,  Tj=109.6°C  ✓ PASS
  RAIL 2 (-7V):  Vce=19V, Pd=3.02W/dev, Tj=110.0°C  ✓ PASS
  Both parallel pairs operate within SOA and thermal
  limits well below 150°C max.
  Emitter ballast RE = 1Ω (single value both rails):
  +12V: V_RE=250mV = 5.0×ΔVBE ✓
  -7V:  V_RE=159mV = 3.2×ΔVBE (acceptable)
- To obtain the maximum possible current gain using Darlington pair it's important to ensure that the driver transistor has enough collector current to ensure acceptable hFE.  When run at very low collector current, most transistors will have a gain that's well below the quoted figure in the datasheet The base-emitter resistor ( @{"Id":"AFOOLCLT\WNVFDPDJ","ObjectType":2} , and @{"Id":"AFOOLCLT\UYARYTMN","ObjectType":2} ) is  sized to ensure that the drive transistor has a collector current that's above the minimum.  The resistor also helps to ensure a faster turn-off and minimises leakage current.
- Linear regulators
- Mohamed Drissi